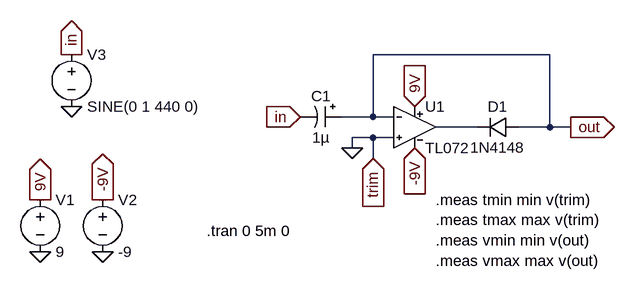
[diagram p0: schematic negative-clamper.asc]
negative-clamper.asc, the LTspice schematic file:
Version 4
SHEET 1 880 680
WIRE 512 144 240 144
WIRE 240 240 240 144
WIRE 240 240 192 240
WIRE 272 240 240 240
WIRE 400 256 336 256
WIRE 512 256 512 144
WIRE 512 256 464 256
WIRE 544 256 512 256
WIRE 240 272 208 272
WIRE 272 272 240 272
WIRE 208 288 208 272
WIRE 240 304 240 272
FLAG 544 256 out
IOPIN 544 256 Out
FLAG 128 240 in
IOPIN 128 240 In
FLAG -272 448 0
FLAG -176 448 0
FLAG -224 224 0
FLAG -272 368 9V
IOPIN -272 368 Out
FLAG -176 368 -9V
IOPIN -176 368 Out
FLAG -224 144 in
IOPIN -224 144 Out
FLAG 304 224 9V
IOPIN 304 224 In
FLAG 304 288 -9V
IOPIN 304 288 In
FLAG 240 304 trim
IOPIN 240 304 In
FLAG 208 288 0
SYMBOL TL072 304 192 R0
SYMATTR InstName U1
SYMBOL diode 464 240 R90
WINDOW 0 0 32 VBottom 2
WINDOW 3 32 32 VTop 2
SYMATTR InstName D1
SYMATTR Value 1N4148
SYMBOL polcap 192 224 R90
WINDOW 0 0 32 VBottom 2
WINDOW 3 32 32 VTop 2
SYMATTR InstName C1
SYMATTR Value 1µ
SYMBOL Voltage -272 352 R0
SYMATTR InstName V1
SYMATTR Value 9
SYMBOL Voltage -176 352 R0
SYMATTR InstName V2
SYMATTR Value -9
SYMBOL Voltage -224 128 R0
SYMATTR InstName V3
SYMATTR Value SINE(0 1 440 0)
TEXT -16 416 Left 2 !.tran 0 5m 0
TEXT 336 368 Left 2 !.meas tmin min v(trim)\n.meas tmax max v(trim)\n.meas vmin min v(out)\n.meas vmax max v(out)

The netlist it stands for:
* negative-clamper.asc
XU1 0 out 9V -9V N001 TL072  ; pins In+ In- V+ V- OUT
D1 out N001 1N4148
C1 out in 1µ
V1 9V 0 9
V2 -9V 0 -9
V3 in 0 SINE(0 1 440 0)
.model D D
.lib standard.dio
.tran 0 5m 0
.meas tmin min v(trim)
.meas tmax max v(trim)
.meas vmin min v(out)
.meas vmax max v(out)
.lib TL072.sub
.backanno
.end